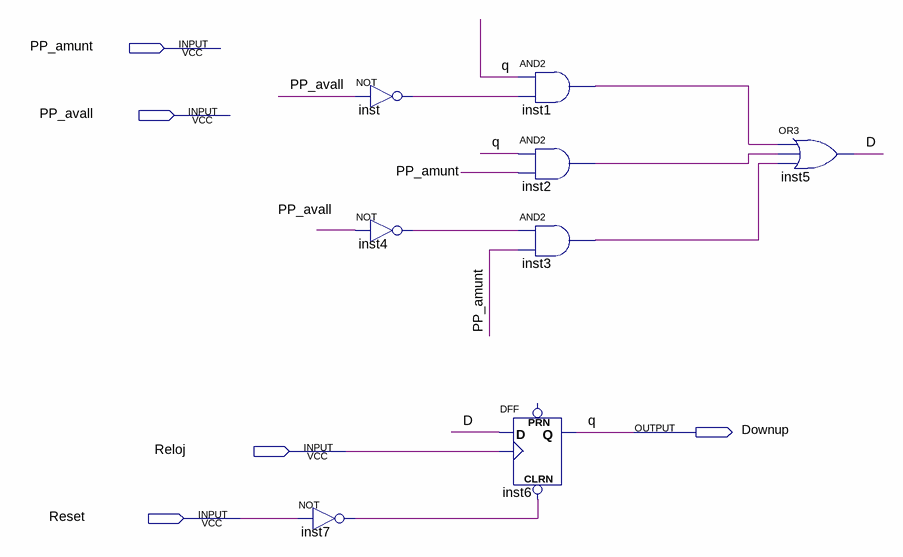
[diagram p0: schematic sheet]
// Quartus schematic UC_DIR.bdf as structural Verilog: 8 symbols, 5 pins
module UC_DIR (
  input  PP_amunt,
  input  PP_avall,
  input  Reloj,
  input  Reset,
  output Downup
);

  wire D, inst1_out, inst2_out, inst3_out, inst4_out, inst7_out, inst_out;

  not inst7 (inst7_out, Reset);
  not inst (inst_out, PP_avall);
  not inst4 (inst4_out, PP_avall);
  and inst1 (inst1_out, Downup, inst_out);
  and inst2 (inst2_out, Downup, PP_amunt);
  and inst3 (inst3_out, inst4_out, PP_amunt);
  DFF inst6 (.CLRN(inst7_out), .CLK(Reloj), .D(D), .Q(Downup));  // open: PRN
  or inst5 (D, inst1_out, inst2_out, inst3_out);

  // Other names for the same wires on the sheet: q = Downup
endmodule
